# Altium schematic sheet Main.SchDoc
size A4; SheetNumber: 1; SheetTotal: 3
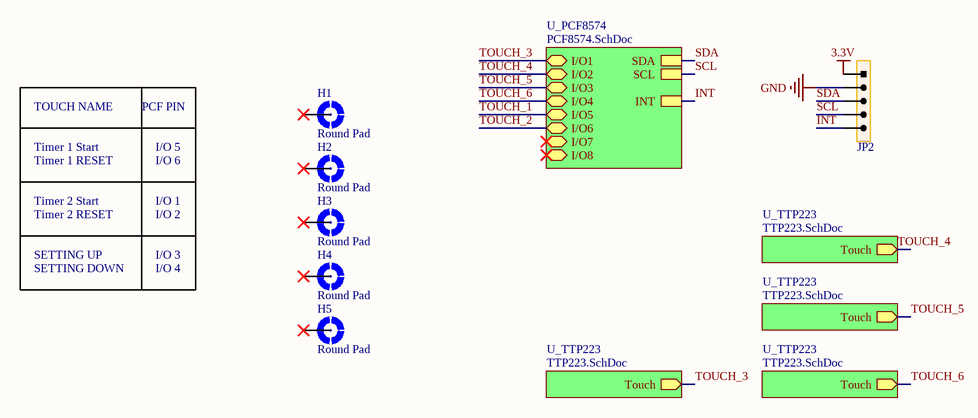
[diagram p0: Main.SchDoc]

## Parts
H1  Round Pad  [P3.2C]  (no BOM)
H2  Round Pad  [P3.2C]  (no BOM)
H3  Round Pad  [P3.2C]  (no BOM)
H4  Round Pad  [P3.2C]  (no BOM)
H5  Round Pad  [P3.2C]  (no BOM)
JP2  HDR-1X5  [XH2.54-5P_H]  (value not drawn)

## Sub-sheets
U_PCF8574 = PCF8574.SchDoc: I/O1 (bidir), I/O2 (bidir), I/O3 (bidir), I/O4 (bidir), I/O5 (bidir), I/O6 (bidir), I/O7 (bidir), I/O8 (bidir), SDA, SCL, INT
U_TTP223 = TTP223.SchDoc: Touch (out)
U_TTP223 = TTP223.SchDoc: Touch (out)
U_TTP223 = TTP223.SchDoc: Touch (out)
U_TTP223 = TTP223.SchDoc: Touch (out)

## Nets
3.3V: JP2.1
GND: JP2.2
SHIELD: H1.P H2.P H3.P H4.P H5.P
INT: JP2.5 ; sheet U_PCF8574/INT
SCL: JP2.4 ; sheet U_PCF8574/SCL
SDA: JP2.3 ; sheet U_PCF8574/SDA
TOUCH_1: sheet U_PCF8574/I/O5
TOUCH_2: sheet U_PCF8574/I/O6
TOUCH_3: sheet U_PCF8574/I/O1, sheet U_TTP223/Touch
TOUCH_4: sheet U_PCF8574/I/O2, sheet U_TTP223/Touch
TOUCH_5: sheet U_PCF8574/I/O3, sheet U_TTP223/Touch
TOUCH_6: sheet U_PCF8574/I/O4, sheet U_TTP223/Touch

## Notes on the sheet
- TOUCH NAME
- PCF PIN
- Timer 1 Start
- Timer 1 RESET
- I/O 5
- I/O 6
- Timer 2 Start
- Timer 2 RESET
- I/O 1
- I/O 2
- SETTING UP
- SETTING DOWN
- I/O 3
- I/O 4

## Library data of the parts
H1-H5 = MOUNT-PAD-ROUND: MOUNTING PAD, round
JP2 = Header 5: 5P Connector; BOM名称: 5P接插件; 版权归属: 源创客; 学习资源: www.ooocke.com